# Altium schematic sheet 02_Sensor.SchDoc
size A4
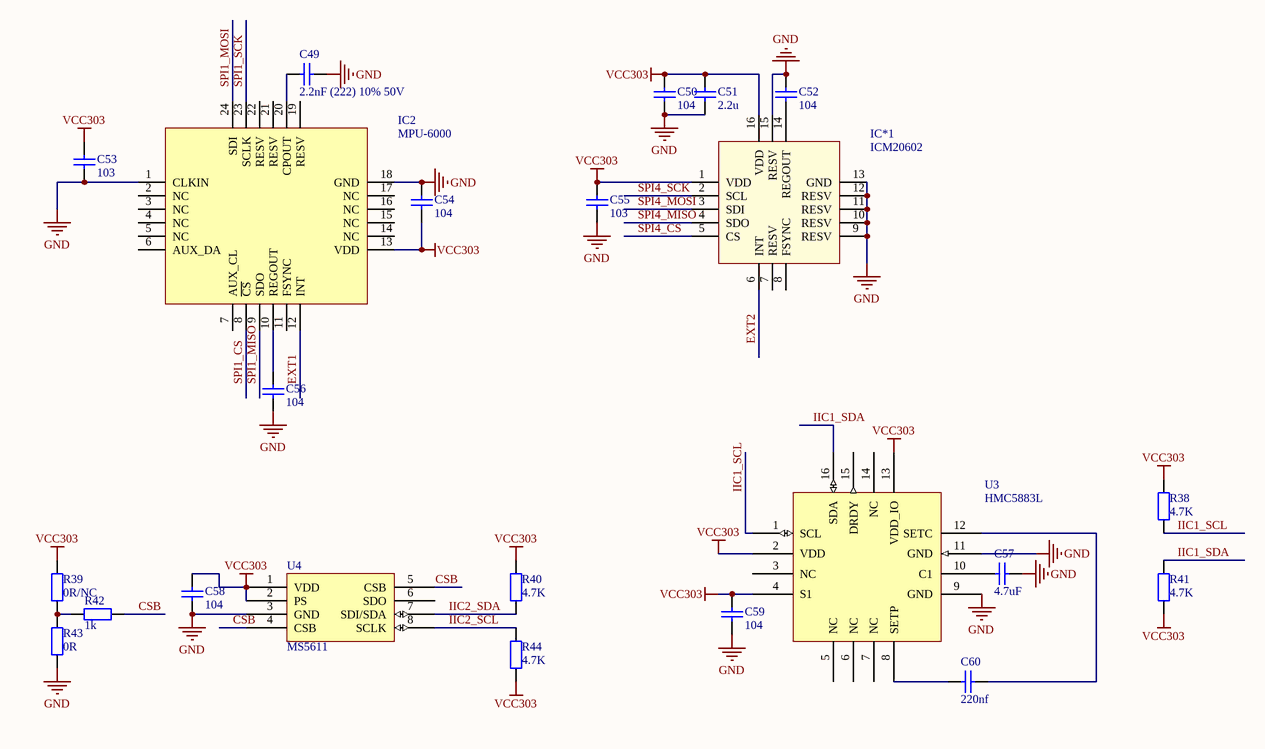
[diagram p0: 02_Sensor.SchDoc]

## Parts
C49  2.2nF (222) 10% 50V  [LC-0402_C]
C50  104  [LC-0402_C]
C51  2.2u  [0603_C]
C52  104  [LC-0402_C]
C53  103  [LC-0402_C]
C54  104  [LC-0402_C]
C55  103  [LC-0402_C]
C56  104  [LC-0402_C]
C57  4.7uF  [0603_C]
C58  104  [LC-0402_C]
C59  104  [LC-0402_C]
C60  220nf  [LC-0402_C]
IC2  MPU-6000  [MPU6000]
IC*1  ICM20602  [LGA16-icm20602]
R38  4.7K  [LC-0402_R]
R39  0R/NC  [LC-0402_R]
R40  4.7K  [LC-0402_R]
R41  4.7K  [LC-0402_R]
R42  1k  [LC-0402_R]
R43  0R  [LC-0402_R]
R44  4.7K  [LC-0402_R]
U3  HMC5883L  [HMC5883L]
U4  MS5611  [MS5611]

## Nets
GND: C49.2 C50.1 C51.1 C52.2 C53.1 C54.2 C55.2 C56.1 C57.1 C58.1 C59.1 IC2.1(CLKIN) IC2.18(GND) IC*1.9(RESV) IC*1.10(RESV) IC*1.11(RESV) IC*1.12(RESV) IC*1.13(GND) IC*1.15(RESV) R43.1 U3.9(GND) U3.11(GND) U4.3(GND)
VCC303: C50.2 C51.2 C53.2 C54.1 C55.1 C58.2 C59.2 IC2.13(VDD) IC*1.1(VDD) IC*1.16(VDD) R38.2 R39.2 R40.2 R41.1 R44.1 U3.2(VDD) U3.4(S1) U3.13(VDD_IO) U4.1(VDD) U4.2(PS)
CSB: R42.2 U4.4(CSB) U4.5(CSB)
EXT1: IC2.12(INT)
EXT2: IC*1.6(INT)
IIC1_SCL: R38.1 U3.1(SCL)
IIC1_SDA: R41.2 U3.16(SDA)
IIC2_SCL: R44.2 U4.8(SCLK)
IIC2_SDA: R40.1 U4.7(SDI/SDA)
SPI1_CS: IC2.8(~{CS})
SPI1_MISO: IC2.9(SDO)
SPI1_MOSI: IC2.24(SDI)
SPI1_SCK: IC2.23(SCLK)
SPI4_CS: IC*1.5(CS)
SPI4_MISO: IC*1.4(SDO)
SPI4_MOSI: IC*1.3(SDI)
SPI4_SCK: IC*1.2(SCL)
NetC49_1: C49.1 IC2.20(CPOUT)
NetC52_1: C52.1 IC*1.14(REGOUT)
NetC56_2: C56.2 IC2.10(REGOUT)
NetC57_2: C57.2 U3.10(C1)
NetC60_1: C60.1 U3.12(SETC)
NetC60_2: C60.2 U3.8(SETP)
NetR39_1: R39.1 R42.1 R43.2

Not connected (* = marked no-connect by the designer): IC2 2(NC) 3(NC) 4(NC) 5(NC) 6(AUX_DA) 7(AUX_CL) 11(FSYNC) 14(NC) 15(NC) 16(NC) 17(NC) 19(RESV) 21(RESV) 22(RESV); IC*1 7(RESV) 8(FSYNC); U3 3(NC) 5(NC) 6(NC) 7(NC) 14(NC) 15(DRDY); U4 6(SDO)

## Library data of the parts
C49-C60 = 0603 2.2nF (222) 10% 50V: 贴片电容; ComponentLink1Description: 供应商链接; ComponentLink1URL: http://www.szlcsc.com/product/details_1956.html; Package: 0603; Supplier: LC; SuppliersPartNumber: C1604
IC2 = MPU-6000: 传感器; ComponentLink1Description: 供应商链接; ComponentLink1URL: http://www.szlcsc.com/product/details_24852.html; Package: QFN-24_4x4x05P; Supplier: LC; SuppliersPartNumber: C24112
R38-R44 = 0603 2.2KΩ (2201) 1%: 贴片电阻; ComponentLink1Description: 供应商链接; ComponentLink1URL: http://www.szlcsc.com/product/details_4597.html; Package: 0603; Supplier: LC; SuppliersPartNumber: C4190
U3 = HMC5883L: 3-Axis Digital Compass